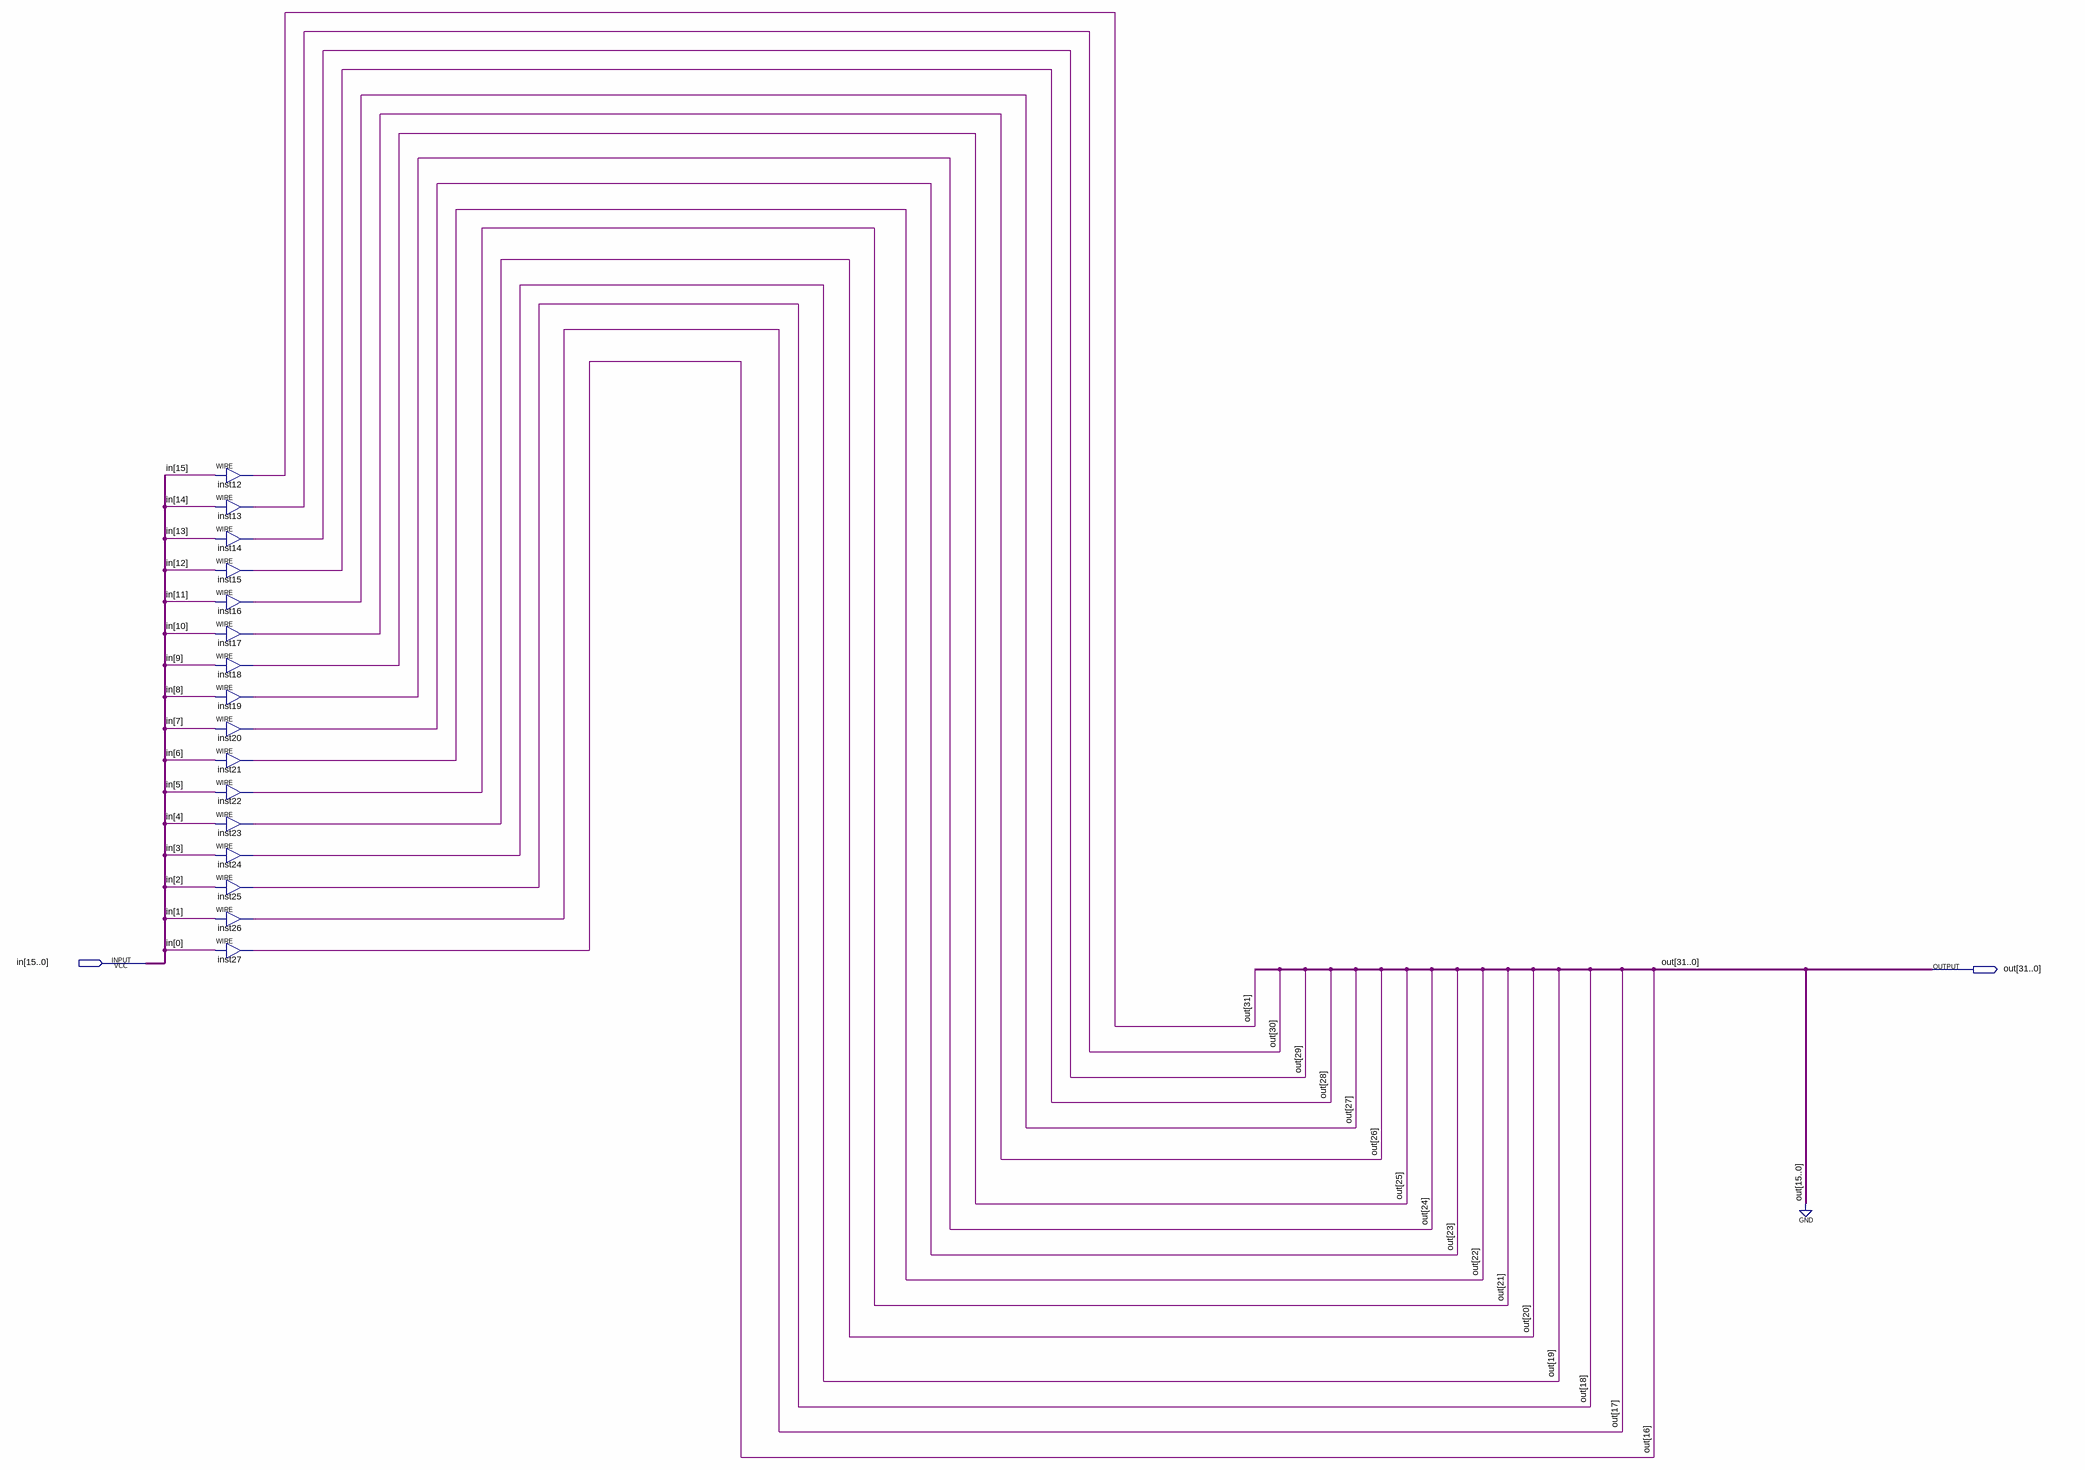
[diagram p0: schematic sheet]
// Quartus schematic LUI.bdf as structural Verilog: 16 symbols, 2 pins
module LUI (
  input  [15:0] in,
  output [31:0] out
);

  assign out[31] = in[15];  // WIRE inst12
  assign out[30] = in[14];  // WIRE inst13
  assign out[29] = in[13];  // WIRE inst14
  assign out[28] = in[12];  // WIRE inst15
  assign out[27] = in[11];  // WIRE inst16
  assign out[26] = in[10];  // WIRE inst17
  assign out[25] = in[9];  // WIRE inst18
  assign out[24] = in[8];  // WIRE inst19
  assign out[23] = in[7];  // WIRE inst20
  assign out[22] = in[6];  // WIRE inst21
  assign out[21] = in[5];  // WIRE inst22
  assign out[20] = in[4];  // WIRE inst23
  assign out[19] = in[3];  // WIRE inst24
  assign out[18] = in[2];  // WIRE inst25
  assign out[17] = in[1];  // WIRE inst26
  assign out[16] = in[0];  // WIRE inst27

  assign out[15:0] = {16{1'b0}};
endmodule
